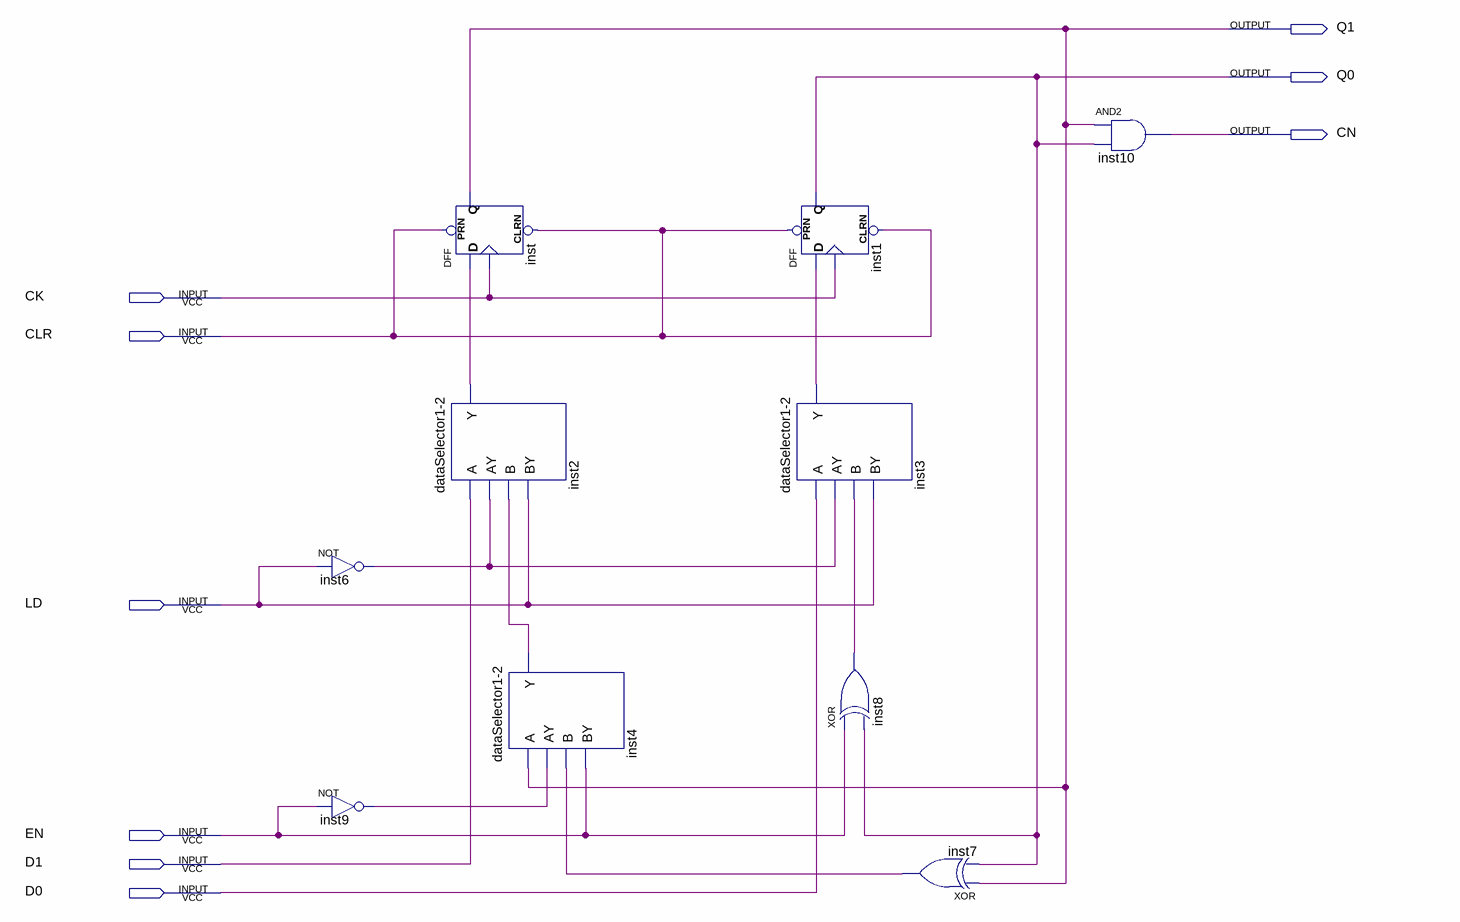
[diagram p0: schematic sheet]
// Quartus schematic counter-2.bdf as structural Verilog: 10 symbols, 9 pins
module \counter-2  (
  input  CK,
  input  CLR,
  input  LD,
  input  EN,
  input  D1,
  input  D0,
  output Q1,
  output Q0,
  output CN
);

  wire inst2_y, inst3_y, inst4_y, inst6_out, inst7_out, inst8_out, inst9_out;

  not inst6 (inst6_out, LD);
  not inst9 (inst9_out, EN);
  DFF inst (.CLRN(CLR), .CLK(CK), .D(inst2_y), .PRN(CLR), .Q(Q1));
  \dataSelector1-2  inst2 (.A(D1), .AY(inst6_out), .B(inst4_y), .BY(LD), .Y(inst2_y));
  \dataSelector1-2  inst4 (.A(Q1), .AY(inst9_out), .B(inst7_out), .BY(EN), .Y(inst4_y));
  \dataSelector1-2  inst3 (.A(D0), .AY(inst6_out), .B(inst8_out), .BY(LD), .Y(inst3_y));
  DFF inst1 (.CLRN(CLR), .CLK(CK), .D(inst3_y), .PRN(CLR), .Q(Q0));
  xor inst8 (inst8_out, EN, Q0);
  xor inst7 (inst7_out, Q1, Q0);
  and inst10 (CN, Q1, Q0);
endmodule
